# Altium schematic sheet Main.SchDoc
size Letter
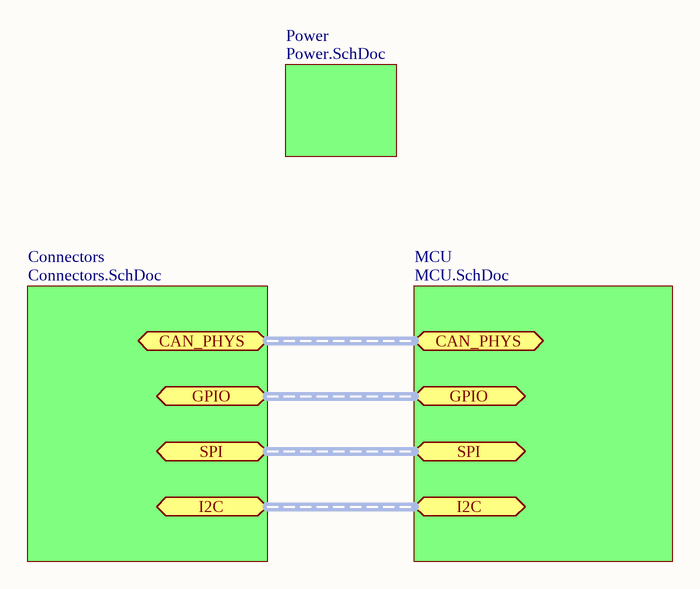
[diagram p0: Main.SchDoc]

## Sub-sheets
Connectors = Connectors.SchDoc: no entries
MCU = MCU.SchDoc: no entries
Power = Power.SchDoc: no entries

## Ports
CAN_PHYS (harness CAN_PHYS), GPIO (harness GPIO), I2C (harness I2C), SPI (harness SPI)